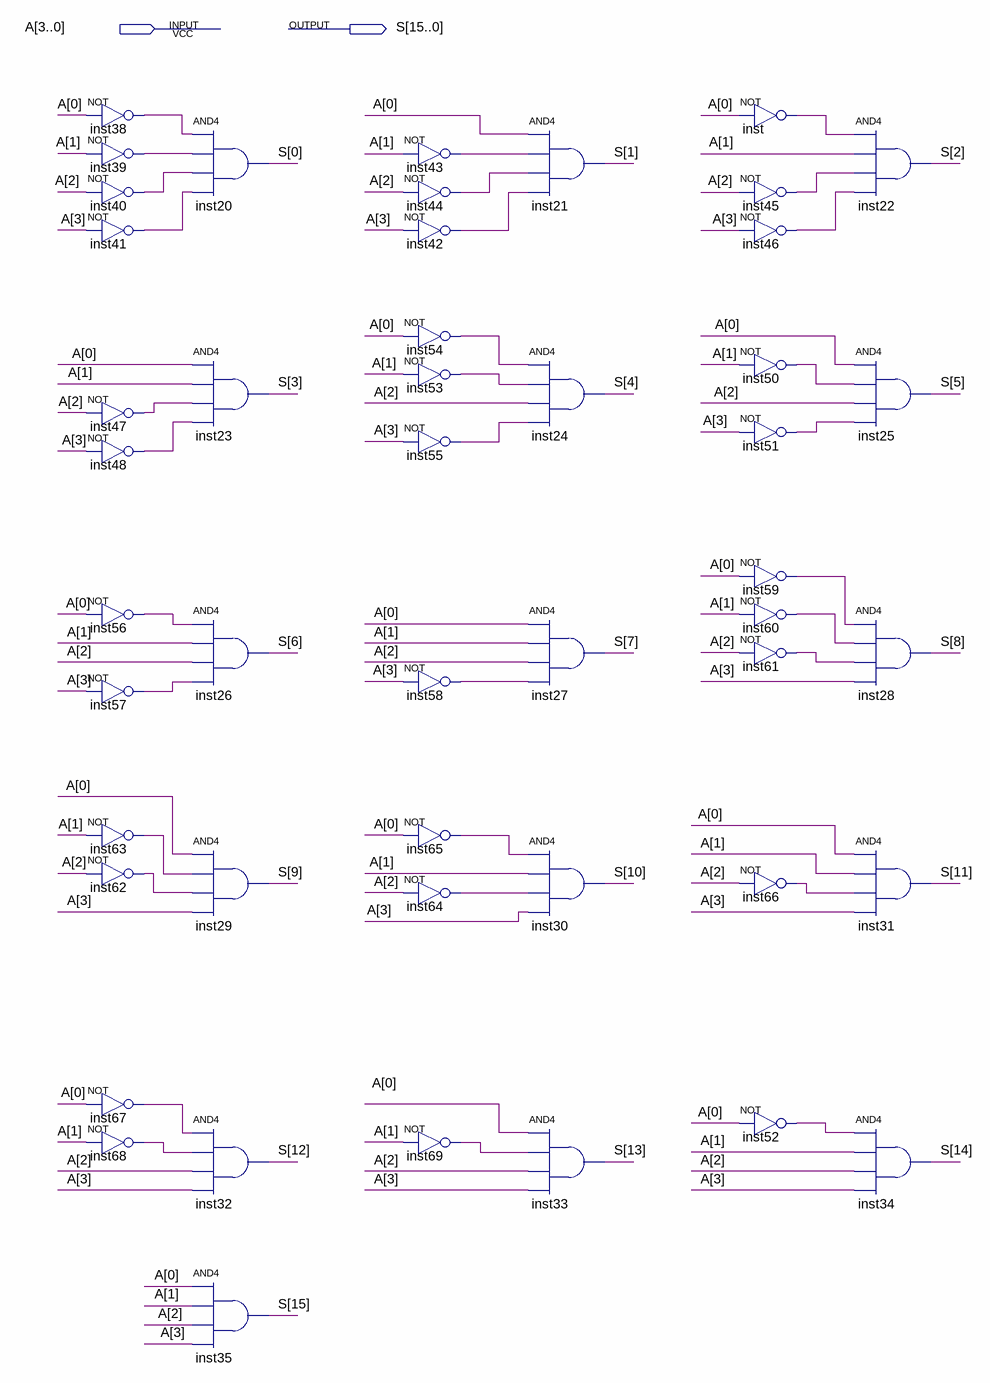
[diagram p0: schematic sheet]
// Quartus schematic Decodificado4_16.bdf as structural Verilog: 48 symbols, 2 pins
module Decodificado4_16 (
  input  [3:0] A,
  output [15:0] S
);

  wire inst38_out, inst39_out, inst40_out, inst41_out, inst42_out, inst43_out, inst44_out, inst45_out,
       inst46_out, inst47_out, inst48_out, inst50_out, inst51_out, inst52_out, inst53_out, inst54_out,
       inst55_out, inst56_out, inst57_out, inst58_out, inst59_out, inst60_out, inst61_out, inst62_out,
       inst63_out, inst64_out, inst65_out, inst66_out, inst67_out, inst68_out, inst69_out, inst_out;

  not inst38 (inst38_out, A[0]);
  not inst39 (inst39_out, A[1]);
  not inst40 (inst40_out, A[2]);
  not inst41 (inst41_out, A[3]);
  not inst47 (inst47_out, A[2]);
  not inst48 (inst48_out, A[3]);
  not inst56 (inst56_out, A[0]);
  not inst57 (inst57_out, A[3]);
  not inst63 (inst63_out, A[1]);
  not inst62 (inst62_out, A[2]);
  not inst67 (inst67_out, A[0]);
  not inst68 (inst68_out, A[1]);
  and inst20 (S[0], inst38_out, inst39_out, inst40_out, inst41_out);
  and inst23 (S[3], A[0], A[1], inst47_out, inst48_out);
  and inst26 (S[6], inst56_out, A[1], A[2], inst57_out);
  and inst29 (S[9], A[0], inst63_out, inst62_out, A[3]);
  and inst32 (S[12], inst67_out, inst68_out, A[2], A[3]);
  and inst35 (S[15], A[0], A[1], A[2], A[3]);
  not inst43 (inst43_out, A[1]);
  not inst44 (inst44_out, A[2]);
  not inst42 (inst42_out, A[3]);
  not inst54 (inst54_out, A[0]);
  not inst53 (inst53_out, A[1]);
  not inst55 (inst55_out, A[3]);
  not inst58 (inst58_out, A[3]);
  not inst65 (inst65_out, A[0]);
  not inst64 (inst64_out, A[2]);
  not inst69 (inst69_out, A[1]);
  and inst21 (S[1], A[0], inst43_out, inst44_out, inst42_out);
  and inst24 (S[4], inst54_out, inst53_out, A[2], inst55_out);
  and inst27 (S[7], A[0], A[1], A[2], inst58_out);
  and inst30 (S[10], inst65_out, A[1], inst64_out, A[3]);
  and inst33 (S[13], A[0], inst69_out, A[2], A[3]);
  not inst (inst_out, A[0]);
  not inst45 (inst45_out, A[2]);
  not inst46 (inst46_out, A[3]);
  not inst50 (inst50_out, A[1]);
  not inst51 (inst51_out, A[3]);
  not inst59 (inst59_out, A[0]);
  not inst60 (inst60_out, A[1]);
  not inst61 (inst61_out, A[2]);
  not inst66 (inst66_out, A[2]);
  not inst52 (inst52_out, A[0]);
  and inst22 (S[2], inst_out, A[1], inst45_out, inst46_out);
  and inst25 (S[5], A[0], inst50_out, A[2], inst51_out);
  and inst28 (S[8], inst59_out, inst60_out, inst61_out, A[3]);
  and inst31 (S[11], A[0], A[1], inst66_out, A[3]);
  and inst34 (S[14], inst52_out, A[1], A[2], A[3]);
endmodule
